# Altium schematic sheet AA.SchDoc
size A; SheetNumber: 9; SheetTotal: 11
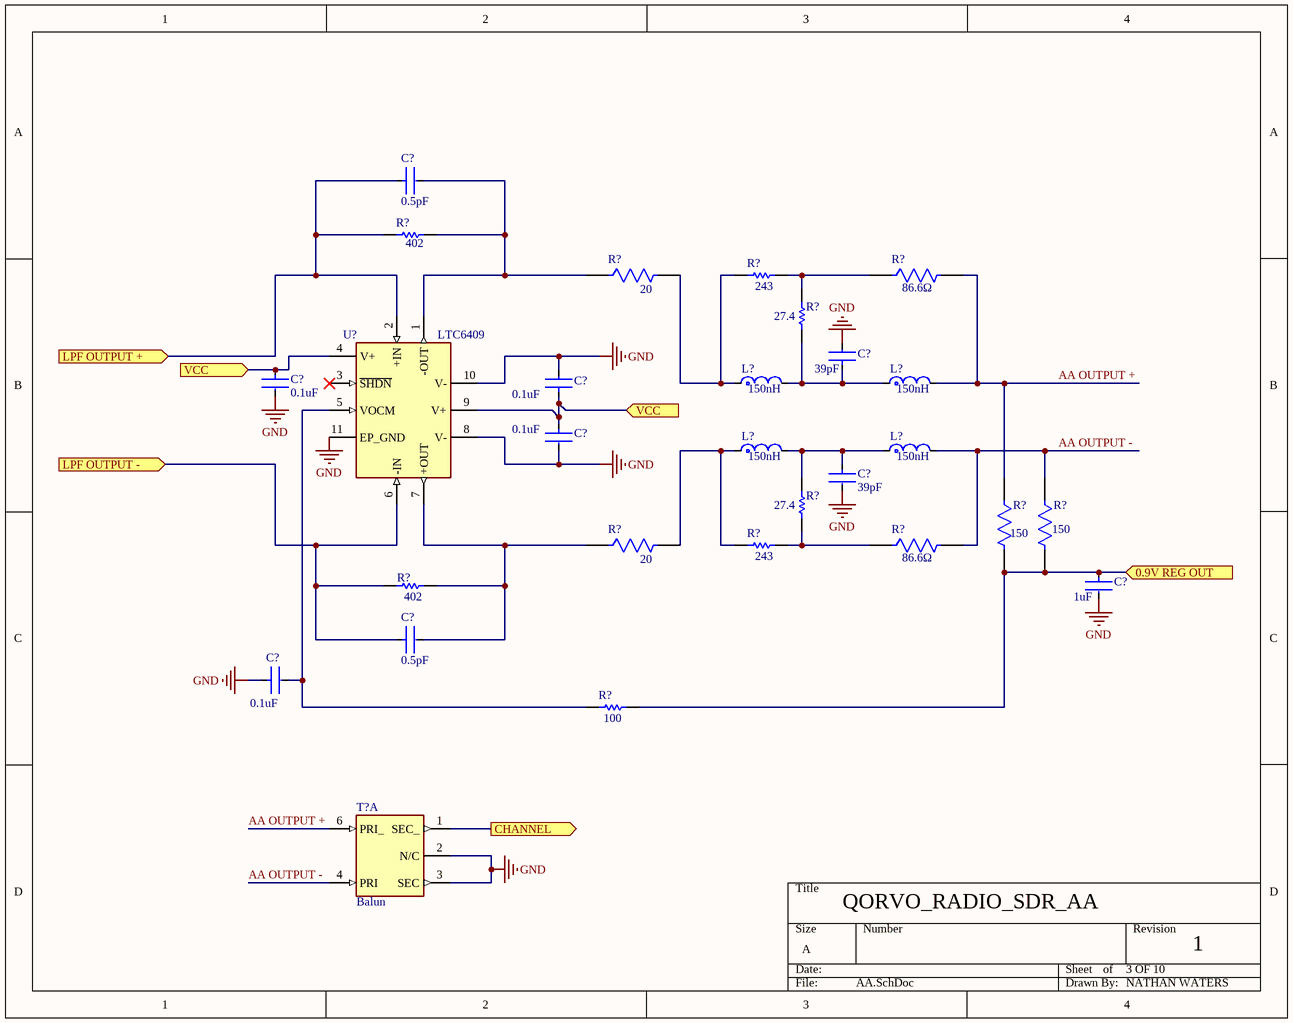
[diagram p0: AA.SchDoc]

## Parts
(Parts that share a designator on the sheet are numbered #1, #2 ... from top to bottom, then left to right.)
C?#1  Capacitance: 0.5pF  [FP-GJM155-0_05-IPC_A]  (hidden comment: GJM1555C1HR50CB01D)
C?#2  Capacitance: 0.1uF  [FP-GRM155-0_05-MFG]  (hidden comment: GRM155R71C104KA88J)
C?#3  Capacitance: 39pF  [FP-GJM155-0_05-IPC_C]  (hidden comment: GJM1555C1H390JB01D)
C?#4  Capacitance: 0.1uF  [FP-GRM155-0_05-MFG]  (hidden comment: GRM155R71C104KA88J)
C?#5  Capacitance: 0.1uF  [FP-GRM155-0_05-MFG]  (hidden comment: GRM155R71C104KA88J)
C?#6  Capacitance: 39pF  [FP-GJM155-0_05-IPC_C]  (hidden comment: GJM1555C1H390JB01D)
C?#7  CAPACITANCE: 1uF  [FP-GRM155-0_1-MFG]  (hidden comment: GRM155R61H105KE05D)
C?#8  Capacitance: 0.5pF  [FP-GJM155-0_05-IPC_A]  (hidden comment: GJM1555C1HR50CB01D)
C?#9  Capacitance: 0.1uF  [FP-GRM155-0_05-MFG]  (hidden comment: GRM155R71C104KA88J)
L?#1  Inductance: 150nH  [FP-LQG15HH_02-IPC_C]  (hidden comment: LQG15HSR15H02D)
L?#2  Inductance: 150nH  [FP-LQG15HH_02-IPC_C]  (hidden comment: LQG15HSR15H02D)
L?#3  Inductance: 150nH  [FP-LQG15HH_02-IPC_C]  (hidden comment: LQG15HSR15H02D)
L?#4  Inductance: 150nH  [FP-LQG15HH_02-IPC_C]  (hidden comment: LQG15HSR15H02D)
R?#1  RESISTANCE: 402  [RESC1005X40X25ML05T05]  (hidden comment: CRCW0402402RFKED)
R?#2  RESISTANCE: 243  [RESC1005X40X25ML05T05]  (hidden comment: CRCW0402243RFKED)
R?#3  Resistance: 20  [FP-CRCW0402-e3-IPC_C]  (hidden comment: CRCW040220R0FKED)
R?#4  Resistance: 86.6Ω  [Vishay_CRCW0402-e3_MFG]  (hidden comment: CRCW040286R6FKED)
R?#5  RESISTANCE: 27.4  [RESC1005X40X25LL05T05]  (hidden comment: CRCW040227R4FKED)
R?#6  Resistance: 150  [FP-CRCW0402-e3-IPC_A]  (hidden comment: CRCW0402150RFKED)
R?#7  Resistance: 150  [FP-CRCW0402-e3-IPC_A]  (hidden comment: CRCW0402150RFKED)
R?#8  RESISTANCE: 27.4  [RESC1005X40X25LL05T05]  (hidden comment: CRCW040227R4FKED)
R?#9  RESISTANCE: 243  [RESC1005X40X25ML05T05]  (hidden comment: CRCW0402243RFKED)
R?#10  Resistance: 20  [FP-CRCW0402-e3-IPC_C]  (hidden comment: CRCW040220R0FKED)
R?#11  Resistance: 86.6Ω  [Vishay_CRCW0402-e3_MFG]  (hidden comment: CRCW040286R6FKED)
R?#12  RESISTANCE: 402  [RESC1005X40X25ML05T05]  (hidden comment: CRCW0402402RFKED)
R?#13  RESISTANCE: 100  [RESC1005X40X25LL05T10]  (hidden comment: CRCW0402100RFKEDHP)
T?  Balun  [TC1-1-13M+]  (part A of 3)
U?  LTC6409  [LTC6409IUDBTRMPBF]

## Ports
0.9V REG OUT (in, see 0.9V REG[2B]), CHANNEL (out), LPF OUTPUT + (in, see LPF[3B]), LPF OUTPUT - (in, see LPF[3C]), VCC (in, see 0.9V REG[3B], 3.3v REG[3B], AA[1B], HE LNA[3A], HE Mixer[3C], LE LNA[3A], LE Mixer[3C], LPF[1B], SWITCH[3B]), VCC (in, see 0.9V REG[3B], 3.3v REG[3B], AA[2B], HE LNA[3A], HE Mixer[3C], LE LNA[3A], LE Mixer[3C], LPF[1B], SWITCH[3B])

## Nets
GND: C?#2.2 C?#3.2 C?#4.2 C?#5.2 C?#6.2 C?#7.2 C?#9.1 T?.2(N/C) T?.3(SEC) U?.8(V-) U?.10(V-) U?.11(EP_GND)
0.9V REG OUT: C?#7.1 R?#6.2 R?#7.2 R?#13.2 ; port 0.9V REG OUT
AA OUTPUT +: L?#2.2 R?#4.2 R?#6.1 T?.6(PRI_)
AA OUTPUT -: L?#4.2 R?#7.1 R?#11.2 T?.4(PRI)
CHANNEL: T?.1(SEC_) ; port CHANNEL
LPF OUTPUT +: C?#1.1 R?#1.1 U?.2(+IN) ; port LPF OUTPUT +
LPF OUTPUT -: C?#8.1 R?#12.1 U?.6(-IN) ; port LPF OUTPUT -
VCC: C?#2.1 C?#4.1 C?#5.1 U?.4(V+) U?.9(V+) ; port VCC
NetC?#1_2: C?#1.2 R?#1.2 R?#3.1 U?.1(-OUT)
NetC?#3_1: C?#3.1 L?#1.2 L?#2.1 R?#5.1
NetC?#6_1: C?#6.1 L?#3.2 L?#4.1 R?#8.2
NetC?#8_2: C?#8.2 R?#10.1 R?#12.2 U?.7(+OUT)
NetC?#9_2: C?#9.2 R?#13.1 U?.5(VOCM)
NetL?#1_1: L?#1.1 R?#2.1 R?#3.2
NetL?#3_1: L?#3.1 R?#9.1 R?#10.2
NetR?#2_2: R?#2.2 R?#4.1 R?#5.2
NetR?#8_1: R?#8.1 R?#9.2 R?#11.1

Not connected (* = marked no-connect by the designer): U? 3(~{SHDN})*

## Notes on the sheet
- QORVO_RADIO_SDR_AA
- 3 OF 10
- 1
- NATHAN WATERS

## Library data of the parts
C?#1 C?#8 = CMP-2008-03905-2: Multi-Layer Ceramic Capacitor 0.5pF C0G  ±0.25pF 0402 Paper T/R; Voltage Rating: 50V; Depth: 0.5mm; Max Operating Temperature: 125°C; Termination: SMD/SMT; Min Operating Temperature: -55°C; Case Code (Metric): 1005; Dielectric: C0G; Radiation Hardening: No; Packaging: Tape and Reel; Thickness: 0.022inch; Package Quantity: 1; Mount: Surface Mount; Voltage Rating (DC): 50V; Lead Free: Lead Free; Height: 0.5mm; Length: 1mm; Case Code (Imperial): 0402; Width: 0.02inch; Case/Package: 0402
C?#2 C?#4 C?#5 C?#9 = CMP-2008-03928-2: NexarPartId: 9223238; Manufacturer Lifecycle Status: NRND; Voltage: 16V; Tolerance: 10%; Dielectric: X7R; Material: Ceramic; Schedule B: 8532240020, 8532240020; Mount: Surface Mount; Case/Package: 0402; Case Code (Imperial): 0402; Min Operating Temperature: -55°C; Length: 1mm; Voltage Rating (DC): 16V; Depth: 500µm; Lead Free: Lead Free; Max Operating Temperature: 125°C; Case Code (Metric): 1005; Radiation Hardening: No; Height: 550µm; Voltage Rating: 16V; Packaging: Cut Tape; RoHS: Compliant; Width: 500µm; Number of Pins: 2; REACH SVHC: No SVHC; Termination: SMD/SMT; Thickness: 500µm
C?#3 C?#6 = CMP-06035-049432-1: Multi-Layer Ceramic Capacitor 39pF C0G  ±5% 0402 Paper T/R; Voltage Rating (DC): 50V; Length: 1mm; Thickness: 500um; Width: 500um; Tolerance: 5%; Dielectric: C0G
C?#7 = CMP-06035-026840-2: CERAMIC CAP, MLCC 1UF 50VDC X5R
L?#1-L?#4 = CMP-06042-000342-1: Multilayer type RF Inductor 150nH ±3% 2.99Ω 150mA 0402; Shielding: Unshielded; Self Resonant Frequency: 550MHz; DC Resistance (DCR): 2.99R; Test Frequency: 100MHz; Peripherals: Brown-out Detect/Reset; Interface: I2C; Frequency: 300MHz; Core Material: Air; Number of I/Os: 75; Core Architecture: ARM; Memory Size: 1MB; Oscillator Type: Internal; Memory Type: FLASH; Current Rating: 150mA; Number of Pins: 100; Case/Package: 0402; Case Code (Metric): 1005; Tolerance: 3%; Case Code (Imperial): 0402; Mount: Surface Mount; Max Operating Temperature: 105°C; Packaging: Tape and Reel; Min Operating Temperature: -55°C
R?#1 R?#12 = CMP-1011-00465-2: Manufacturer: Vishay Dale; Part Number: CRCW0402402RFKED
R?#2 R?#9 = CMP-2002-08400-1: Manufacturer: Vishay Dale; Part Number: CRCW0402243RFKED
R?#3 R?#10 = CMP-2002-08359-2: RES Thick Film, 20Ω, 1%, 0.063W, 100ppm/°C, 0402; Voltage Rating: 50V; Max Power Dissipation: 63mW; Mount: Surface Mount; Packaging: Tape and Reel; Military Standard: Not; Height: 0.35mm; Depth: 0.5mm; Lead Free: Lead Free; Number of Terminations: 2; Contact Plating: Tin; Max Operating Temperature: 155°C; Package Quantity: 10; Termination: SMD/SMT; Min Operating Temperature: -55°C; Features: Automotive AEC-Q200; Radiation Hardening: No; Case Code (Metric): 1005; Width: 0.02inch; Composition: Thick Film; Case/Package: 0402; Case Code (Imperial): 0402; Temperature Coefficient: 100ppm/°C; Tolerance: 1%; Power Rating: 63mW; Voltage Rating (DC): 50V; Length: 1mm; Weight: 2.3E-05oz
R?#4 R?#11 = CMP-1011-00390-3: NexarPartId: 39818855; Voltage Rating (DC): 50V; Temperature Coefficient: 100ppm/°C; Power Rating: 63mW; Tolerance: 1%; Features: Automotive AEC-Q200; Lead Free: Lead Free; Number of Terminations: 2; Military Standard: Not; Case Code (Imperial): 0402; Voltage Rating: 50V; Case Code (Metric): 1005; Termination: SMD/SMT; Radiation Hardening: No; Max Power Dissipation: 63mW; REACH SVHC: Unknown; Number of Pins: 2; Length: 1mm; Height: 400µm; Contact Plating: Tin; Weight: 652.039032µg; Depth: 500µm; Max Operating Temperature: 155°C; Min Operating Temperature: -55°C; Case/Package: 0402; Composition: Thick Film; RoHS: Compliant; Width: 500µm; Packaging: Cut Tape
R?#5 R?#8 = CMP-2002-08436-1: Manufacturer: Vishay Dale; Part Number: CRCW040227R4FKED
R?#6 R?#7 = CMP-2002-08214-2: RES Thick Film, 150Ω, 1%, 0.063W, 100ppm/°C, 0402; Power Rating: 63mW; Voltage Rating: 50V; Packaging: Tape and Reel; Height: 0.35mm; Radiation Hardening: No; Min Operating Temperature: -55°C; Mount: Surface Mount; Contact Plating: Tin; Case/Package: 0402; Width: 0.5mm; Case Code (Imperial): 0402; Length: 1mm; Tolerance: 1%; Lead Free: Lead Free; Case Code (Metric): 1005; Military Standard: Not; Max Operating Temperature: 155°C; Temperature Coefficient: 100ppm/°C; Weight: 2.3E-05oz; Voltage Rating (DC): 50V; Depth: 0.5mm; Package Quantity: 10000; Composition: Thick Film; Termination: SMD/SMT
R?#13 = CMP-2002-03042-1: Manufacturer: Vishay Dale; Part Number: CRCW0402100RFKEDHP
T? = TC1-1-13M+: ComponentLink1Description: Data Sheet; ComponentLink1URL: https://www.minicircuits.com/pdfs/TC1-1-13M+.pdf; ComponentLink2Description: Manufactuer; ComponentLink2URL: Mini-Circuits; ComponentLink3Description: Part Number; ComponentLink3URL: TC1-1-13M+
U? = LTC6409IUDB#TRMPBF: DIFF OP AMP; Manufacturer_Name: Analog Devices; Manufacturer_Part_Number: LTC6409IUDB#TRMPBF; Datasheet Link: https://www.analog.com/media/en/technical-documentation/data-sheets/6409fb.pdf